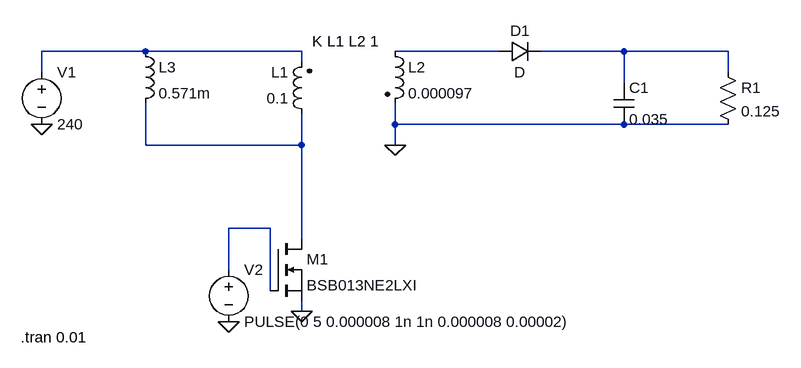
[diagram p0: schematic flyback converter.asc]
flyback converter.asc, the LTspice schematic file:
Version 4
SHEET 1 1080 680
WIRE -192 -112 -352 -112
WIRE 48 -112 -192 -112
WIRE 352 -112 192 -112
WIRE 544 -112 416 -112
WIRE 704 -112 544 -112
WIRE 48 -96 48 -112
WIRE -352 -80 -352 -112
WIRE 704 -80 704 -112
WIRE 544 -64 544 -112
WIRE 192 0 192 -32
WIRE 544 0 192 0
WIRE 704 0 544 0
WIRE -192 32 -192 -32
WIRE 48 32 48 -16
WIRE 48 32 -192 32
WIRE 192 32 192 0
WIRE 0 160 -64 160
WIRE 48 176 48 32
WIRE -64 224 -64 160
WIRE 0 256 0 160
WIRE 48 288 48 272
FLAG -352 0 0
FLAG -64 304 0
FLAG 48 288 0
FLAG 192 32 0
SYMBOL voltage -352 -96 R0
WINDOW 123 0 0 Left 0
WINDOW 39 0 0 Left 0
SYMATTR InstName V1
SYMATTR Value 240
SYMBOL voltage -64 208 R0
WINDOW 123 0 0 Left 0
WINDOW 39 0 0 Left 0
SYMATTR InstName V2
SYMATTR Value PULSE(0 5 0.000008 1n 1n 0.000008 0.00002)
SYMBOL cap 528 -64 R0
SYMATTR InstName C1
SYMATTR Value 0.035
SYMBOL res 688 -96 R0
SYMATTR InstName R1
SYMATTR Value 0.125
SYMBOL ind2 64 0 R180
WINDOW 0 36 80 Left 2
WINDOW 3 36 40 Left 2
SYMATTR InstName L1
SYMATTR Value 0.1
SYMATTR Type ind
SYMBOL ind2 176 -128 R0
SYMATTR InstName L2
SYMATTR Value 0.000097
SYMATTR Type ind
SYMBOL nmos 0 176 R0
SYMATTR InstName M1
SYMATTR Value BSB013NE2LXI
SYMBOL ind -208 -128 R0
SYMATTR InstName L3
SYMATTR Value 0.571m
SYMBOL diode 352 -96 R270
WINDOW 0 32 32 VTop 2
WINDOW 3 0 32 VBottom 2
SYMATTR InstName D1
TEXT 64 -128 Left 2 !K L1 L2 1
TEXT -384 328 Left 2 !.tran 0.01

The netlist it stands for:
* flyback converter.asc
V1 N001 0 240
V2 N005 0 PULSE(0 5 0.000008 1n 1n 0.000008 0.00002)
C1 N003 0 0.035
R1 N003 0 0.125
L1 N004 N001 0.1
L2 N002 0 0.000097
M1 N004 N005 0 0 BSB013NE2LXI
L3 N001 N004 0.571m
D1 N002 N003 D
.model D D
.lib standard.dio
.model NMOS NMOS
.model PMOS PMOS
.lib standard.mos
K L1 L2 1
.tran 0.01
.backanno
.end